# EAGLE design working (EAGLE 7.7.0)
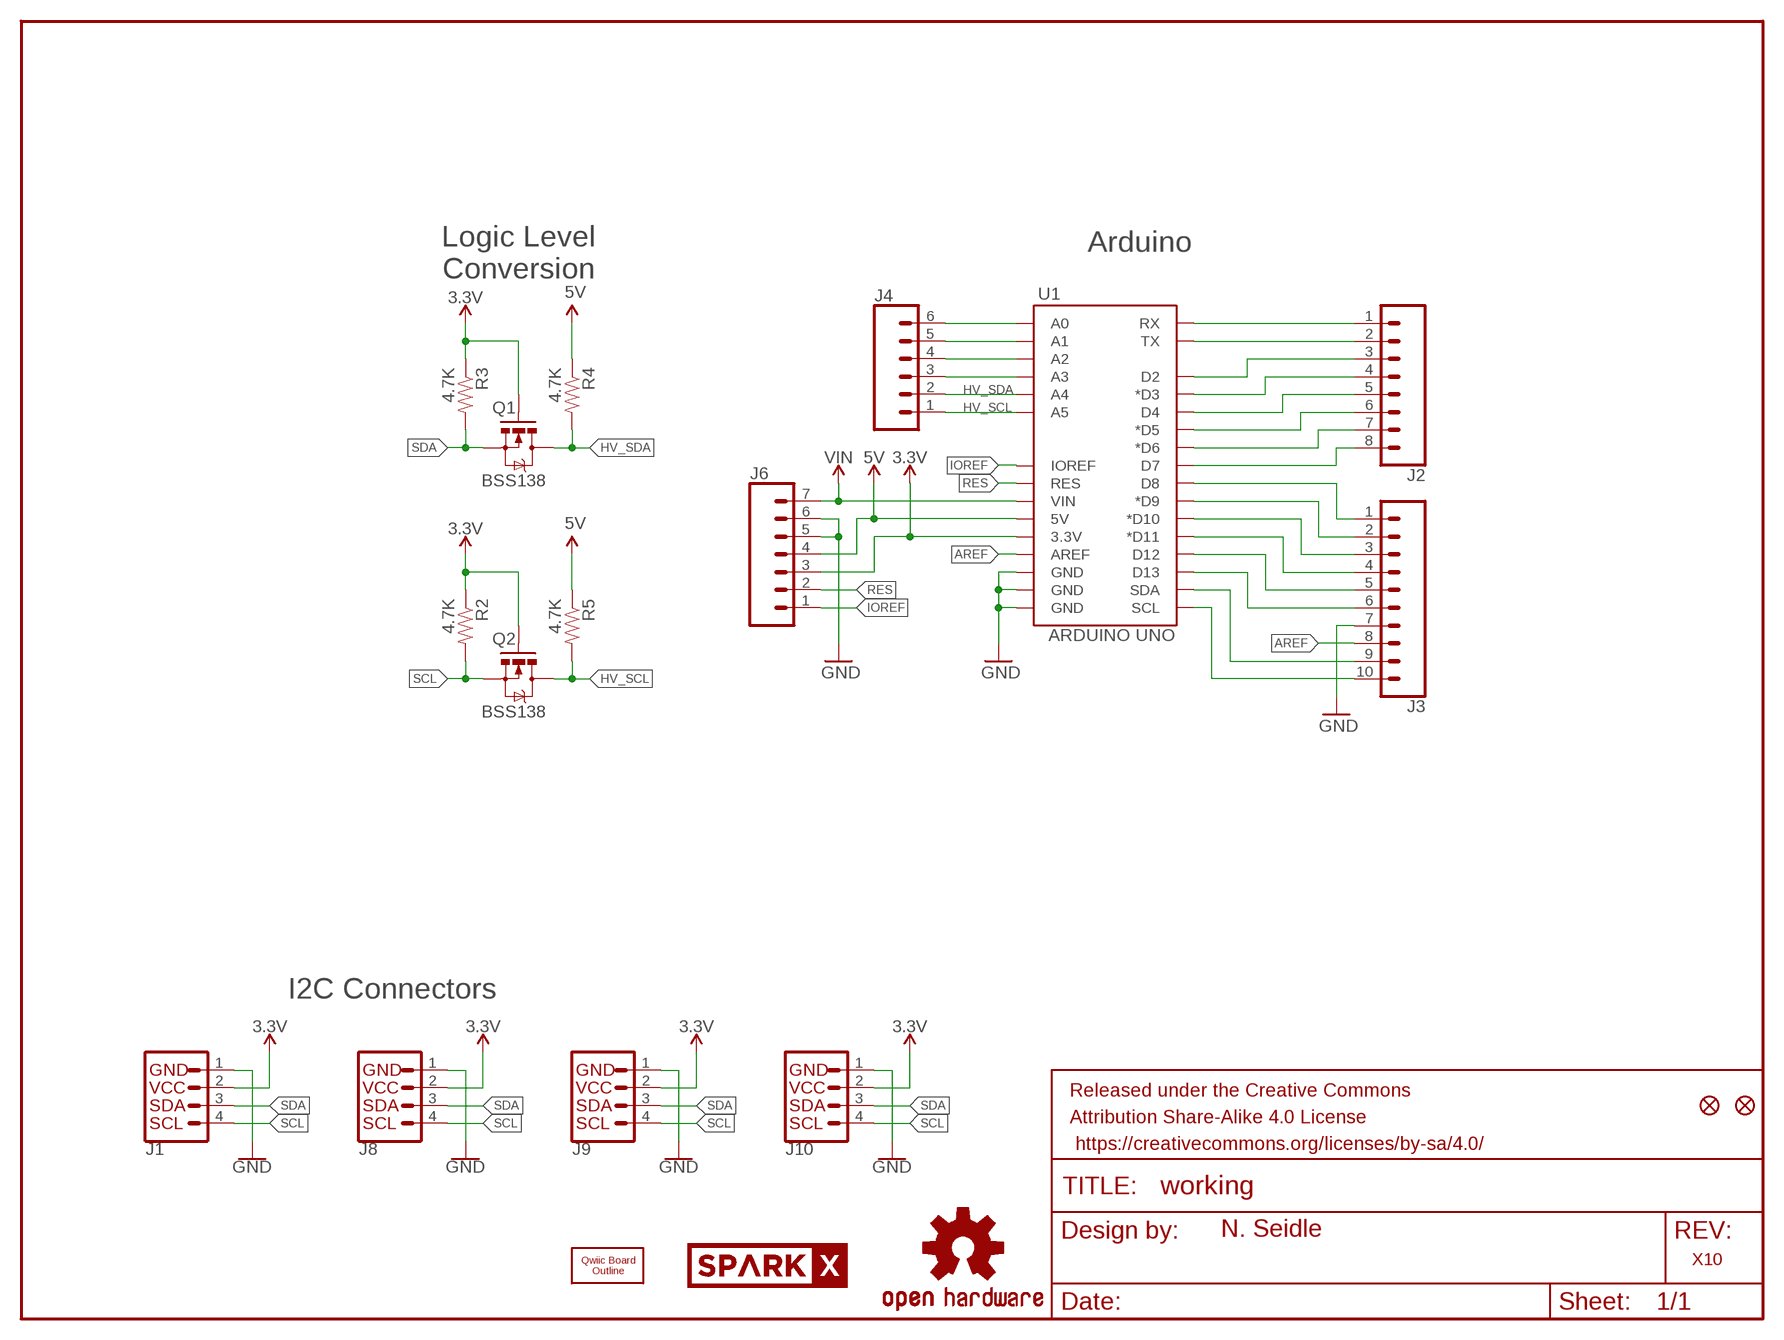
[diagram p0: schematic, sheet 1]

## Parts
FD1  FIDUCIAL1X2  [FIDUCIAL-1X2]
FD2  FIDUCIAL1X2  [FIDUCIAL-1X2]
FRAME1  FRAME-LETTER  [CREATIVE_COMMONS]
J1  I2C_STANDARDJS-1MM  [1X04_1MM_RA]
J2  CONN_08NO_SILK_FEMALE_PTH  [1X08_NO_SILK]
J3  CONN_10NO_SILK_PTH_FEMALE  [1X10_NO_SILK]
J4  CONN_06NO_SILK_FEMALE_PTH  [1X06_NO_SILK]
J6  CONN_07NO_SILK  [1X07_NO_SILK]
J8  I2C_STANDARDJS-1MM  [1X04_1MM_RA]
J9  I2C_STANDARDJS-1MM  [1X04_1MM_RA]
J10  I2C_STANDARDJS-1MM  [1X04_1MM_RA]
LOGO1  OSHW-LOGOMINI  [OSHW-LOGO-MINI]
Q1  BSS138  MOSFET-NCHANNELBSS138  [SOT23-3]
Q2  BSS138  MOSFET-NCHANNELBSS138  [SOT23-3]
R2  4.7K  4.7KOHM-1/10W-1%(0603)  [0603-RES]
R3  4.7K  4.7KOHM-1/10W-1%(0603)  [0603-RES]
R4  4.7K  4.7KOHM-1/10W-1%(0603)  [0603-RES]
R5  4.7K  4.7KOHM-1/10W-1%(0603)  [0603-RES]
U1  ARDUINO UNO  ARDUINO_R3_SHIELDNOLABELS  [UNO_R3_SHIELD_NOLABELS]
U$1  SPARKX-LOGO3  [SPARKX-SMALL]
U$2  SPARKX-LOGO5  [SPARKX-LARGE]
U$3  QWIIC_BOARD_OUTLINEH  [QWIIC_BOARD_MOUNT_HOLES]

## Nets
3.3V: J1.2(VCC) J6.3 J8.2(VCC) J9.2(VCC) J10.2(VCC) Q1.1(G) Q2.1(G) R2.1 R3.1 U1.3.3V
5V: J6.4 R4.1 R5.1 U1.5V
A0: J4.6 U1.A0
A1: J4.5 U1.A1
A2: J4.4 U1.A2
A3: J4.3 U1.A3
AREF: J3.8 U1.AREF
D2: J2.3 U1.D2
D3: J2.4 U1.D3(*D3)
D4: J2.5 U1.D4
D5: J2.6 U1.D5(*D5)
D6: J2.7 U1.D6(*D6)
D7: J2.8 U1.D7
D8: J3.1 U1.D8
D9: J3.2 U1.D9(*D9)
D10: J3.3 U1.D10(*D10)
D11: J3.4 U1.D11(*D11)
D12: J3.5 U1.D12
D13: J3.6 U1.D13
GND [vcc]: J1.1(GND) J3.7 J6.5 J6.6 J8.1(GND) J9.1(GND) J10.1(GND) U1.GND@0(GND) U1.GND@1(GND) U1.GND@2(GND)
HV_SCL: J4.1 Q2.3(D) R5.2 U1.A5
HV_SDA: J4.2 Q1.3(D) R4.2 U1.A4
IOREF: J6.1 U1.IOREF
RES: J6.2 U1.RES
RX: J2.1 U1.RX
SCL: J1.4(SCL) J8.4(SCL) J9.4(SCL) J10.4(SCL) Q2.2(S) R2.2
SCL1: J3.10 U1.SCL
SDA: J1.3(SDA) J8.3(SDA) J9.3(SDA) J10.3(SDA) Q1.2(S) R3.2
SDA1: J3.9 U1.SDA
TX: J2.2 U1.TX
VIN [vcc]: J6.7 U1.VIN

## Notes on the sheet
- Logic Level
  Conversion
- Arduino
- I2C Connectors
- N. Seidle
- X10

## Library data of the parts
FD1 FD2 = SparkFun-Aesthetics:FIDUCIAL: Fiducial Alignment Points Various fiducial points for machine vision alignment.
FRAME1 = SparkFun-Aesthetics:FRAME-LETTER: Schematic Frame Standard 8.5x11 US Letter frame
J1 J8-J10 = SparkX:I2C_STANDARD: SparkFun I2C Standard Pinout Header SparkFun has standardized on a pinout for all I2C based sensor breakouts. This pinout allows I2C boards to be plugged directly into the headers on Arduino Uno compatible boards, and to be daisy chained easily. Example SparkFun Products: SparkFun Atmospheric Sensor Breakout - BME280 <https://www.sparkfun.com/products/13676> SparkFun Altitude/Pressure Sensor Breakout - MPL3115A2 <https://www.sparkfun.com/products/11084> SparkFun TOF Range Finder Sensor - VL6180 <https://www.sparkfun.com/products/12785>
J2 = SparkFun-Connectors:CONN_08: Multi connection point. Often used as Generic Header-pin footprint for 0.1 inch spaced/style header connections On any of the 0.1 inch spaced packages, you can populate with these: Break Away Headers - Straight <https://www.sparkfun.com/products/116> (PRT-00116) Break Away Male Headers - Right Angle <https://www.sparkfun.com/products/553> (PRT-00553) Female Headers <https://www.sparkfun.com/products/115> (PRT-00115) Break Away Headers - Machine Pin <https://www.sparkfun.com/products/117> (PRT-00117) Break Away Female Headers - Swiss Machine Pin <https://www.sparkfun.com/products/743> (PRT-00743) Arduino Stackable Header - 8 Pin <https://www.sparkfun.com/products/9279> (PRT-09279) For SCREWTERMINALS and SPRING TERMINALS visit here: Screw Terimnals on SparkFun.com <https://www.sparkfun.com/search/results?term=Screw+Terminals> (5mm/3.5mm/2.54mm spacing) This device is also useful as a general connection point to wire up your design to another part of your project. Our various solder wires solder well into these plated through hole pads. Hook-Up Wire - Assortment (Stranded, 22 AWG) <https://www.sparkfun.com/products/11375> (PRT-11375) Hook-Up Wire - Assortment (Solid Core, 22 AWG) <https://www.sparkfun.com/products/11367> (PRT-11367) View the entire wire category on our website here <https://www.sparkfun.com/categories/141> Special notes: Molex polarized connector foot print use with SKU : PRT-08231 with associated crimp pins and housings. 1MM SMD Version SKU: PRT-10208 NOTES ON THE VARIANTS LOCK and LOCK_LONGPADS... This footprint was designed to help hold the alignment of a through-hole component (i.e. 6-pin header) while soldering it into place. You may notice that each hole has been shifted either up or down by 0.005 of an inch from it's more standard position (which is a perfectly straight line). This slight alteration caused the pins (the squares in the middle) to touch the edges of the holes. Because they are alternating, it causes a "brace" to hold the component in place. 0.005 has proven to be the perfect amount of "off-center" position when using our standard breakaway headers. Although looks a little odd when you look at the bare footprint, once you have a header in there, the alteration is very hard to notice. Also,if you push a header all the way into place, it is covered up entirely on the bottom side.; PROD_ID: CONN-08438
J3 = SparkFun-Connectors:CONN_10: Multi connection point. Often used as Generic Header-pin footprint for 0.1 inch spaced/style header connections On any of the 0.1 inch spaced packages, you can populate with these: Break Away Headers - Straight <https://www.sparkfun.com/products/116> (PRT-00116) Break Away Male Headers - Right Angle <https://www.sparkfun.com/products/553> (PRT-00553) Female Headers <https://www.sparkfun.com/products/115> (PRT-00115) Break Away Headers - Machine Pin <https://www.sparkfun.com/products/117> (PRT-00117) Break Away Female Headers - Swiss Machine Pin <https://www.sparkfun.com/products/743> (PRT-00743) Arduino Stackable Header - 10 Pin <https://www.sparkfun.com/products/11376> (PRT-11376) For SCREWTERMINALS and SPRING TERMINALS visit here: Screw Terimnals on SparkFun.com <https://www.sparkfun.com/search/results?term=Screw+Terminals> (5mm/3.5mm/2.54mm spacing) This device is also useful as a general connection point to wire up your design to another part of your project. Our various solder wires solder well into these plated through hole pads. Hook-Up Wire - Assortment (Stranded, 22 AWG) <https://www.sparkfun.com/products/11375> (PRT-11375) Hook-Up Wire - Assortment (Solid Core, 22 AWG) <https://www.sparkfun.com/products/11367> (PRT-11367) View the entire wire category on our website here <https://www.sparkfun.com/categories/141> Special notes: Molex polarized connector foot print use with SKU : PRT-08231 with associated crimp pins and housings. 1MM SMD Version SKU: PRT-10208 NOTES ON THE VARIANTS LOCK and LOCK_LONGPADS... This footprint was designed to help hold the alignment of a through-hole component (i.e. 6-pin header) while soldering it into place. You may notice that each hole has been shifted either up or down by 0.005 of an inch from it's more standard position (which is a perfectly straight line). This slight alteration caused the pins (the squares in the middle) to touch the edges of the holes. Because they are alternating, it causes a "brace" to hold the component in place. 0.005 has proven to be the perfect amount of "off-center" position when using our standard breakaway headers. Although looks a little odd when you look at the bare footprint, once you have a header in there, the alteration is very hard to notice. Also,if you push a header all the way into place, it is covered up entirely on the bottom side.; PROD_ID: CONN-11563
J4 = SparkFun-Connectors:CONN_06: Multi connection point. Often used as Generic Header-pin footprint for 0.1 inch spaced/style header connections On any of the 0.1 inch spaced packages, you can populate with these: Break Away Headers - Straight <https://www.sparkfun.com/products/116> (PRT-00116) Break Away Male Headers - Right Angle <https://www.sparkfun.com/products/553> (PRT-00553) Female Headers <https://www.sparkfun.com/products/115> (PRT-00115) Break Away Headers - Machine Pin <https://www.sparkfun.com/products/117> (PRT-00117) Break Away Female Headers - Swiss Machine Pin <https://www.sparkfun.com/products/743> (PRT-00743) Arduino Stackable Header - 6 Pin <https://www.sparkfun.com/products/9280> (PRT-09280) For SCREWTERMINALS and SPRING TERMINALS visit here: Screw Terimnals on SparkFun.com <https://www.sparkfun.com/search/results?term=Screw+Terminals> (5mm/3.5mm/2.54mm spacing) This device is also useful as a general connection point to wire up your design to another part of your project. Our various solder wires solder well into these plated through hole pads. Hook-Up Wire - Assortment (Stranded, 22 AWG) <https://www.sparkfun.com/products/11375> (PRT-11375) Hook-Up Wire - Assortment (Solid Core, 22 AWG) <https://www.sparkfun.com/products/11367> (PRT-11367) View the entire wire category on our website here <https://www.sparkfun.com/categories/141>; PROD_ID: CONN-08437
J6 = SparkFun-Connectors:CONN_07: Multi connection point. Often used as Generic Header-pin footprint for 0.1 inch spaced/style header connections On any of the 0.1 inch spaced packages, you can populate with these: Break Away Headers - Straight <https://www.sparkfun.com/products/116> (PRT-00116) Break Away Male Headers - Right Angle <https://www.sparkfun.com/products/553> (PRT-00553) Female Headers <https://www.sparkfun.com/products/115> (PRT-00115) Break Away Headers - Machine Pin <https://www.sparkfun.com/products/117> (PRT-00117) Break Away Female Headers - Swiss Machine Pin <https://www.sparkfun.com/products/743> (PRT-00743) For SCREWTERMINALS and SPRING TERMINALS visit here: Screw Terimnals on SparkFun.com <https://www.sparkfun.com/search/results?term=Screw+Terminals> (5mm/3.5mm/2.54mm spacing) This device is also useful as a general connection point to wire up your design to another part of your project. Our various solder wires solder well into these plated through hole pads. Hook-Up Wire - Assortment (Stranded, 22 AWG) <https://www.sparkfun.com/products/11375> (PRT-11375) Hook-Up Wire - Assortment (Solid Core, 22 AWG) <https://www.sparkfun.com/products/11367> (PRT-11367) View the entire wire category on our website here <https://www.sparkfun.com/categories/141> Special notes: Molex polarized connector foot print use with SKU : PRT-08231 with associated crimp pins and housings. 1MM SMD Version SKU: PRT-10208 NOTES ON THE VARIANTS LOCK and LOCK_LONGPADS... This footprint was designed to help hold the alignment of a through-hole component (i.e. 6-pin header) while soldering it into place. You may notice that each hole has been shifted either up or down by 0.005 of an inch from it's more standard position (which is a perfectly straight line). This slight alteration caused the pins (the squares in the middle) to touch the edges of the holes. Because they are alternating, it causes a "brace" to hold the component in place. 0.005 has proven to be the perfect amount of "off-center" position when using our standard breakaway headers. Although looks a little odd when you look at the bare footprint, once you have a header in there, the alteration is very hard to notice. Also,if you push a header all the way into place, it is covered up entirely on the bottom side.
LOGO1 = SparkFun-Aesthetics:OSHW-LOGO: Open Source Hardware Logo This logo indicates the piece of hardware it is found on incorporates a OSHW license and/or adheres to the definition of open source hardware found here: http://freedomdefined.org/OSHW
Q1 Q2 = SparkFun-DiscreteSemi:MOSFET-NCHANNEL: Common NMOSFET Parts MFG P/N Store ID Prod ID FDD8780 TRANS-09984 SI7820DN TRANS-11055 FDS6630A IC-08089 2N7002PW TRANS-11151 FQP30N06L COM-10213 TRANS-10060 BSS123LT1G TRANS-08345 BSS138 TRANS-00830 BS170 2N7000; PROD_ID: TRANS-00830; VALUE: 200mA/50V
R2-R5 = SparkFun-Resistors:4.7KOHM-1/10W-1%(0603): RES-07857; PROD_ID: RES-07857
U1 = SparkFun-Boards:ARDUINO_R3_SHIELD: Shield form compatible with the Arduino Uno R3.
U$1 U$2 = SparkX:SPARKX-LOGO
U$3 = SparkX:QWIIC_BOARD_OUTLINE: Standard Outline of a Qwiic Board. Good for defining a spot on shields and board areas in which to mount a Qwiic Board.

## Net classes
0 Default: width 0.203 mm
1 vcc: width 0.203 mm

## Board
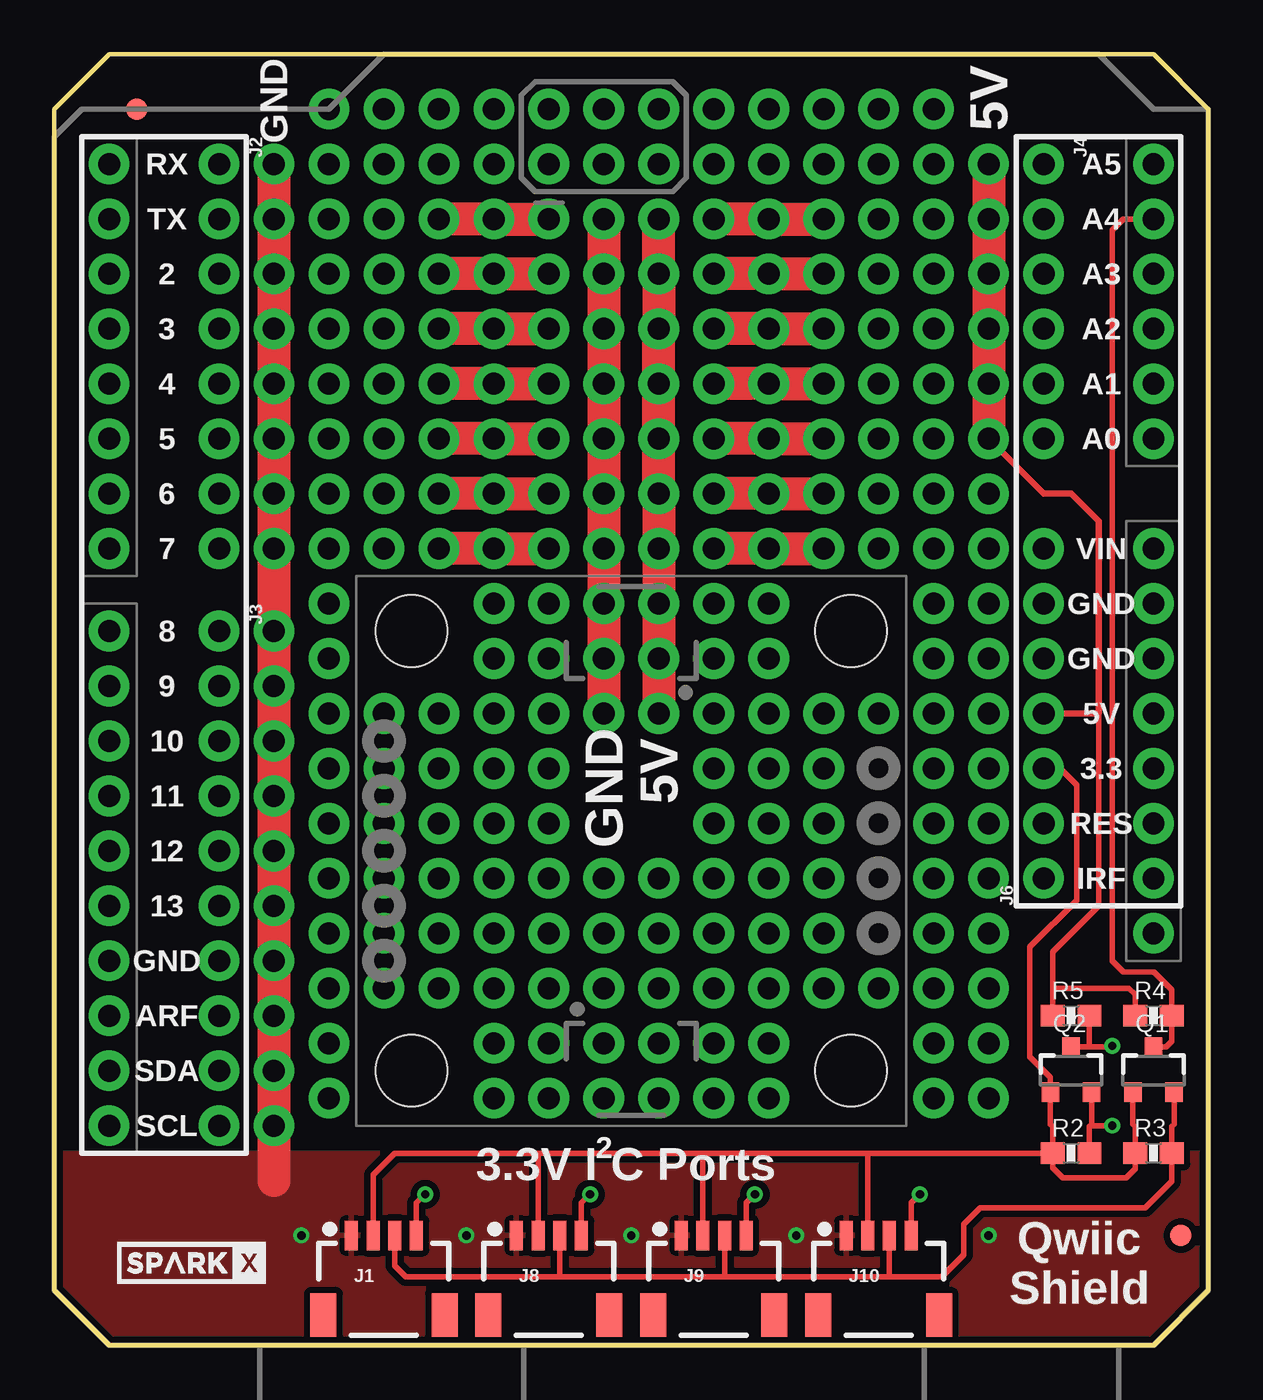
[diagram p1: board, top side]
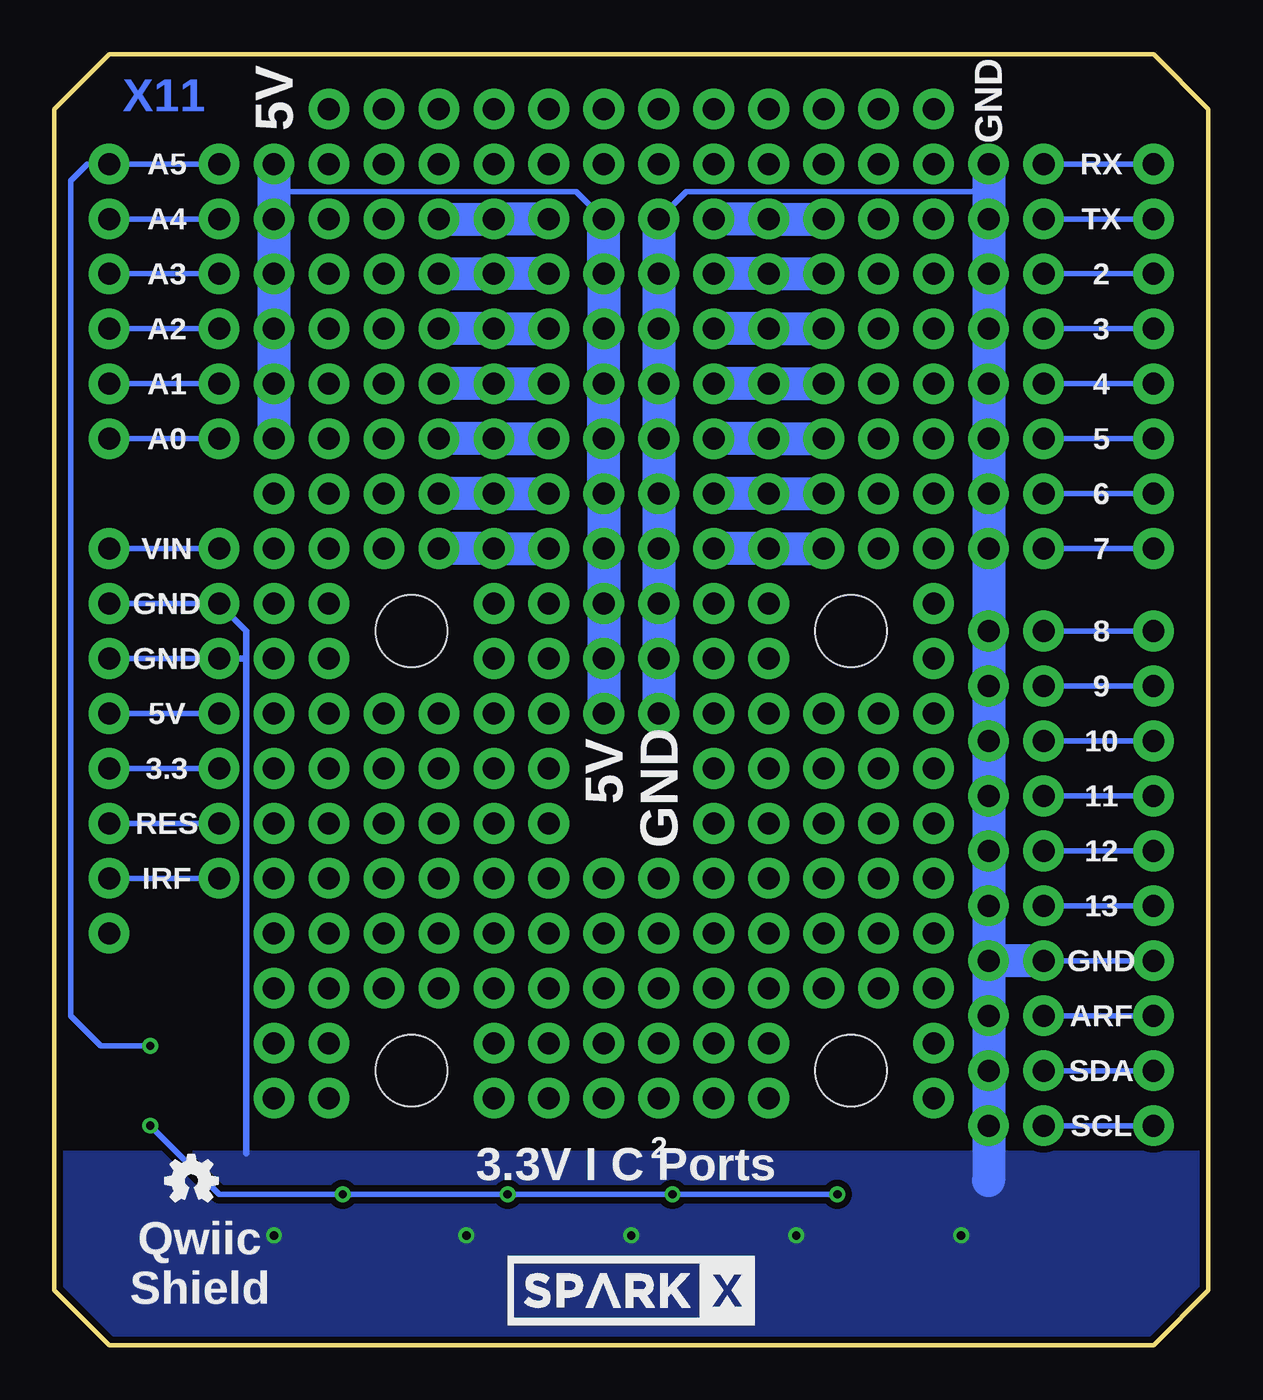
[diagram p2: board, bottom side, seen from below]

Size 53.34 x 59.69 mm. Coordinates in mm from the lower left corner, seen from the top.
Outline: 53.34,2.54 53.34,57.15 50.8,59.69 2.54,59.69 0,57.15 0,2.54 2.54,0 50.8,0 53.34,2.54
Copper layers (1*16): Top 0.035mm / dielectric 1.5mm / Bottom 0.035mm
Design rules "SparkFun-2-layer-TIGHT": minimum track width 7mil, minimum drill 15mil, track to track 7mil, track to pad 7mil, pad to pad 7mil, via to via 7mil, smd to smd 7mil, copper to edge 7mil, drill to drill 7mil, minimum pad ring 7mil, minimum via ring 7mil, stop-mask expansion 4mil, vias tented up to drill 25mil, thermal gap 10mil

### Footprints (pad centres in the part's own frame; a part is rotated, then mirrored left to right if it is on the bottom)
FIDUCIAL-1X2 = smd 1 x 1: 1 0,0
1X04_1MM_RA = smd 0.6 x 1.35: 1 -1.5,0; 2 -0.5,0; 3 0.5,0; 4 1.5,0 | smd 1.2 x 2: NC1 2.8,-3.675; NC2 -2.8,-3.675
1X08_NO_SILK = drill 1.016 pad 1.88: 1 0,0; 2 2.54,0; 3 5.08,0; 4 7.62,0; 5 10.16,0; 6 12.7,0; 7 15.24,0; 8 17.78,0
1X10_NO_SILK = drill 1.016 pad 1.88: 1 0,0; 2 2.54,0; 3 5.08,0; 4 7.62,0; 5 10.16,0; 6 12.7,0; 7 15.24,0; 8 17.78,0; 9 20.32,0; 10 22.86,0
1X06_NO_SILK = drill 1.016 pad 1.88: 1 0,0; 2 2.54,0; 3 5.08,0; 4 7.62,0; 5 10.16,0; 6 12.7,0
1X07_NO_SILK = drill 1.016 pad 1.88: 1 0,0; 2 2.54,0; 3 5.08,0; 4 7.62,0; 5 10.16,0; 6 12.7,0; 7 15.24,0
SOT23-3 = smd 0.8 x 0.9: 1 -0.95,-1; 2 0.95,-1; 3 0,1.1
0603-RES = smd 1.1 x 1: 1 -0.85,0; 2 0.85,0
UNO_R3_SHIELD_NOLABELS = drill 1.016 pad 1.88: 3.3V 50.8,26.67; 5V 50.8,29.21; A0 50.8,41.91; A1 50.8,44.45; A2 50.8,46.99; A3 50.8,49.53; A4 50.8,52.07; A5 50.8,54.61; AREF 2.54,15.24; D2 2.54,49.53; D3 2.54,46.99; D4 2.54,44.45; D5 2.54,41.91; D6 2.54,39.37; D7 2.54,36.83; D8 2.54,33.02; D9 2.54,30.48; D10 2.54,27.94; D11 2.54,25.4; D12 2.54,22.86; D13 2.54,20.32; GND@0 50.8,31.75; GND@1 50.8,34.29; GND@2 2.54,17.78; IOREF 50.8,21.59; NC 50.8,19.05; RES 50.8,24.13; RX 2.54,54.61; SCL 2.54,10.16; SDA 2.54,12.7; TX 2.54,52.07; VIN 50.8,36.83
QWIIC_BOARD_MOUNT_HOLES = hole 3.302: -10.16,10.16; 10.16,10.16; 10.16,-10.16; -10.16,-10.16

### Placement (x,y rotation side)
FD1  52.07,5.08 0 top
FD2  3.81,57.15 0 top
FRAME1  -8.89,-24.13 0 top  (outside the outline)
J1  15.24,5.08 0 top
J2  7.62,54.61 270 top
J3  7.62,33.02 270 top
J4  45.72,54.61 270 top
J6  45.72,21.59 90 top
J8  22.86,5.08 0 top
J9  30.48,5.08 0 top
J10  38.1,5.08 0 top
LOGO1  46.99,7.62 0 bottom
Q1  50.8,12.7 0 top
Q2  46.99,12.7 0 top
R2  46.99,8.89 0 top
R3  50.8,8.89 0 top
R4  50.8,15.24 0 top
R5  46.99,15.24 0 top
U1  0,0 0 top
U$1  6.35,3.81 0 top
U$2  26.67,2.54 0 bottom
U$3  26.67,22.86 90 top

### Tracks (layer width: path | path; a pad name or v marks a point on that pad's centre or on a via)
3.3V
  Top 0.254: R2.1 37.59,8.89 | 37.59,8.89 29.97,8.89 | 29.97,8.89 22.35,8.89 | 22.35,8.89 15.75,8.89 14.74,7.88 J1.2 | J8.2 22.36,8.88 22.35,8.89 | J9.2 29.98,8.88 29.97,8.89 | J10.2 37.6,8.88 37.59,8.89 | R2.1 46.14,10.12 46.04,10.22 Q2.1 46.04,12.38 45.09,13.34 45.09,18.41 47.24,20.57 47.24,25.91 46.48,26.67 J6.3 | Q1.1 49.85,10.22 49.95,10.12 R3.1 49.95,8.17 49.53,7.75 46.61,7.75 46.14,8.22 R2.1
  Bottom 0.254: J6.3 U1.3.3V
5V  (via drill 1.02 pad 1.88)
  Top 0.254: R4.1 49.95,16.22 49.66,16.51 46.14,16.51 | R5.1 46.14,16.51 | 46.14,16.51 46.14,18.2 48.26,20.32 48.26,29.21
  Top 0.305: v43.18,41.91 45.72,39.37 46.99,39.37 48.26,38.1 48.26,29.21 J6.4
  Top 1.524: v27.94,52.07 v27.94,49.53 v27.94,46.99 v27.94,44.45 v27.94,41.91 v27.94,39.37 v27.94,36.83 v27.94,34.29 v27.94,31.75 v27.94,29.21 | v43.18,54.61 v43.18,52.07 v43.18,49.53 v43.18,46.99 v43.18,44.45 v43.18,41.91
  Bottom 0.254: J6.4 U1.5V | v27.94,52.07 29.21,53.34 43.18,53.34
  Bottom 1.524: v43.18,54.61 43.18,53.34 v43.18,41.91 | v27.94,52.07 v27.94,49.53 v27.94,46.99 v27.94,44.45 v27.94,41.91 v27.94,39.37 v27.94,36.83 v27.94,34.29 v27.94,31.75 v27.94,29.21
A0
  Bottom 0.254: J4.6 U1.A0
A1
  Bottom 0.254: U1.A1 J4.5
A2
  Bottom 0.254: J4.4 U1.A2
A3
  Bottom 0.254: U1.A3 J4.3
AREF
  Bottom 0.254: U1.AREF J3.8
CH1  (via drill 1.02 pad 1.88)
  Top 1.524: v30.48,52.07 v33.02,52.07 v35.56,52.07
  Bottom 1.524: v30.48,52.07 v33.02,52.07 v35.56,52.07
CH2  (via drill 1.02 pad 1.88)
  Top 1.524: v30.48,49.53 v33.02,49.53 v35.56,49.53
  Bottom 1.524: v35.56,49.53 v33.02,49.53 v30.48,49.53
CH3  (via drill 1.02 pad 1.88)
  Top 1.524: v30.48,46.99 v33.02,46.99 v35.56,46.99
  Bottom 1.524: v35.56,46.99 v33.02,46.99 v30.48,46.99
CH4  (via drill 1.02 pad 1.88)
  Top 1.524: v30.48,44.45 v33.02,44.45 v35.56,44.45
  Bottom 1.524: v35.56,44.45 v33.02,44.45 v30.48,44.45
CH5  (via drill 1.02 pad 1.88)
  Top 1.524: v30.48,41.91 v33.02,41.91 v35.56,41.91
  Bottom 1.524: v35.56,41.91 v33.02,41.91 v30.48,41.91
CH6  (via drill 1.02 pad 1.88)
  Top 1.524: v30.48,39.37 v33.02,39.37 v35.56,39.37
  Bottom 1.524: v35.56,39.37 v33.02,39.37 v30.48,39.37
CH7  (via drill 1.02 pad 1.88)
  Top 1.524: v30.48,36.83 v33.02,36.83 v35.56,36.83
  Bottom 1.524: v35.56,36.83 v33.02,36.83 v30.48,36.83
CH9  (via drill 1.02 pad 1.88)
  Top 1.524: v17.78,52.07 v20.32,52.07 v22.86,52.07
  Bottom 1.524: v22.86,52.07 v20.32,52.07 v17.78,52.07
CH10  (via drill 1.02 pad 1.88)
  Top 1.524: v17.78,49.53 v20.32,49.53 v22.86,49.53
  Bottom 1.524: v22.86,49.53 v20.32,49.53 v17.78,49.53
CH11  (via drill 1.02 pad 1.88)
  Top 1.524: v17.78,46.99 v20.32,46.99 v22.86,46.99
  Bottom 1.524: v22.86,46.99 v20.32,46.99 v17.78,46.99
CH12  (via drill 1.02 pad 1.88)
  Top 1.524: v17.78,44.45 v20.32,44.45 v22.86,44.45
  Bottom 1.524: v22.86,44.45 v20.32,44.45 v17.78,44.45
CH13  (via drill 1.02 pad 1.88)
  Top 1.524: v17.78,41.91 v20.32,41.91 v22.86,41.91
  Bottom 1.524: v22.86,41.91 v20.32,41.91 v17.78,41.91
CH14  (via drill 1.02 pad 1.88)
  Top 1.524: v17.78,39.37 v20.32,39.37 v22.86,39.37
  Bottom 1.524: v22.86,39.37 v20.32,39.37 v17.78,39.37
CH15  (via drill 1.02 pad 1.88)
  Top 1.524: v17.78,36.83 v20.32,36.83 v22.86,36.83
  Bottom 1.524: v22.86,36.83 v20.32,36.83 v17.78,36.83
D2
  Bottom 0.254: J2.3 U1.D2
D3
  Bottom 0.254: U1.D3 J2.4
D4
  Bottom 0.254: J2.5 U1.D4
D5
  Bottom 0.254: U1.D5 J2.6
D6
  Bottom 0.254: J2.7 U1.D6
D7
  Bottom 0.254: U1.D7 J2.8
D8
  Bottom 0.254: J3.1 U1.D8
D9
  Bottom 0.254: U1.D9 J3.2
D10
  Bottom 0.254: J3.3 U1.D10
D11
  Bottom 0.254: U1.D11 J3.4
D12
  Bottom 0.254: J3.5 U1.D12
D13
  Bottom 0.254: U1.D13 J3.6
GND  (via drill 0.38, 1.02 pad 1.88)
  Top 0.305: 25.4,52.7 v25.4,52.07
  Top 1.524: v25.4,52.07 v25.4,49.53 v25.4,46.99 v25.4,44.45 v25.4,41.91 v25.4,39.37 v25.4,36.83 v25.4,34.29 v25.4,31.75 v25.4,29.21 | v10.16,54.61 v10.16,52.07 v10.16,49.53 v10.16,46.99 v10.16,44.45 v10.16,41.91 v10.16,39.37 v10.16,36.83 v10.16,33.02 v10.16,30.48 v10.16,27.94 v10.16,25.4 v10.16,22.86 v10.16,20.32 v10.16,17.78 v10.16,15.24 v10.16,12.7 v10.16,10.16 10.16,7.62
  Bottom 0.254: U1.GND@1 J6.6 | J6.5 U1.GND@0 | J3.7 U1.GND@2 | 25.4,52.7 24.77,52.7 24.13,53.34 10.16,53.34
  Bottom 0.305: J6.6 44.45,33.02 44.45,31.75 | 44.45,31.75 44.45,8.89 | J6.5 44.45,31.75 | 25.4,52.7 v25.4,52.07
  Bottom 1.524: J3.7 v10.16,17.78 | 10.16,7.62 v10.16,10.16 v10.16,33.02 v10.16,36.83 v10.16,39.37 v10.16,41.91 v10.16,44.45 v10.16,46.99 v10.16,49.53 v10.16,52.07 10.16,53.34 v10.16,54.61 | v25.4,52.07 v25.4,49.53 v25.4,46.99 v25.4,44.45 v25.4,41.91 v25.4,39.37 v25.4,36.83 v25.4,34.29 v25.4,31.75 v25.4,29.21
  other vias: 34.29,5.08 26.67,5.08 19.05,5.08 11.43,5.08 43.18,5.08
  pour Top (isolate 0.305): 53.34,0 0,0 0,8.89 53.34,8.89
  pour Bottom (isolate 0.305): 53.34,0 0,0 0,8.89 53.34,8.89
HV_SCL  (via drill 0.38)
  Top 0.254: Q2.3 47.88,13.8 | 47.88,13.8 48.85,13.8 v48.9,13.84 | R5.2 47.84,13.84 47.88,13.8
  Bottom 0.254: J4.1 U1.A5 51.82,54.61 52.58,53.85 52.58,15.24 51.18,13.84 v48.9,13.84
HV_SDA
  Top 0.254: Q1.3 51.39,13.8 51.65,14.06 R4.2 51.65,16.42 50.8,17.27 49.4,17.27 48.9,17.78 48.9,51.56 49.4,52.07 U1.A4
  Bottom 0.254: J4.2 U1.A4
IOREF
  Bottom 0.254: J6.1 U1.IOREF
N$1  (via drill 1.02 pad 1.88)
  other vias: 15.24,57.15
N$2  (via drill 1.02 pad 1.88)
  other vias: 15.24,54.61
N$3  (via drill 1.02 pad 1.88)
  other vias: 15.24,52.07
N$4  (via drill 1.02 pad 1.88)
  other vias: 12.7,57.15
N$5  (via drill 1.02 pad 1.88)
  other vias: 12.7,54.61
N$6  (via drill 1.02 pad 1.88)
  other vias: 12.7,52.07
N$7  (via drill 1.02 pad 1.88)
  other vias: 12.7,49.53
N$8  (via drill 1.02 pad 1.88)
  other vias: 15.24,49.53
N$9  (via drill 1.02 pad 1.88)
  other vias: 15.24,46.99
N$10  (via drill 1.02 pad 1.88)
  other vias: 12.7,46.99
N$11  (via drill 1.02 pad 1.88)
  other vias: 12.7,44.45
N$12  (via drill 1.02 pad 1.88)
  other vias: 15.24,44.45
N$13  (via drill 1.02 pad 1.88)
  other vias: 15.24,41.91
N$14  (via drill 1.02 pad 1.88)
  other vias: 12.7,41.91
N$15  (via drill 1.02 pad 1.88)
  other vias: 12.7,39.37
N$16  (via drill 1.02 pad 1.88)
  other vias: 15.24,39.37
N$17  (via drill 1.02 pad 1.88)
  other vias: 15.24,36.83
N$18  (via drill 1.02 pad 1.88)
  other vias: 12.7,36.83
N$19  (via drill 1.02 pad 1.88)
  other vias: 12.7,34.29
N$20  (via drill 1.02 pad 1.88)
  other vias: 17.78,54.61
N$21  (via drill 1.02 pad 1.88)
  other vias: 20.32,54.61
N$22  (via drill 1.02 pad 1.88)
  other vias: 22.86,54.61
N$23  (via drill 1.02 pad 1.88)
  other vias: 22.86,34.29
N$24  (via drill 1.02 pad 1.88)
  other vias: 20.32,34.29
N$25  (via drill 1.02 pad 1.88)
  other vias: 30.48,34.29
N$26  (via drill 1.02 pad 1.88)
  other vias: 33.02,34.29
N$27  (via drill 1.02 pad 1.88)
  other vias: 33.02,54.61
N$28  (via drill 1.02 pad 1.88)
  other vias: 30.48,54.61
N$29  (via drill 1.02 pad 1.88)
  other vias: 35.56,54.61
N$30  (via drill 1.02 pad 1.88)
  other vias: 38.1,36.83
N$31  (via drill 1.02 pad 1.88)
  other vias: 40.64,36.83
N$32  (via drill 1.02 pad 1.88)
  other vias: 40.64,39.37
N$33  (via drill 1.02 pad 1.88)
  other vias: 38.1,39.37
N$34  (via drill 1.02 pad 1.88)
  other vias: 38.1,41.91
N$35  (via drill 1.02 pad 1.88)
  other vias: 40.64,41.91
N$36  (via drill 1.02 pad 1.88)
  other vias: 40.64,44.45
N$37  (via drill 1.02 pad 1.88)
  other vias: 38.1,44.45
N$38  (via drill 1.02 pad 1.88)
  other vias: 38.1,46.99
N$39  (via drill 1.02 pad 1.88)
  other vias: 40.64,46.99
N$40  (via drill 1.02 pad 1.88)
  other vias: 40.64,49.53
N$41  (via drill 1.02 pad 1.88)
  other vias: 38.1,49.53
N$42  (via drill 1.02 pad 1.88)
  other vias: 38.1,52.07
N$43  (via drill 1.02 pad 1.88)
  other vias: 40.64,52.07
N$44  (via drill 1.02 pad 1.88)
  other vias: 40.64,54.61
N$45  (via drill 1.02 pad 1.88)
  other vias: 38.1,54.61
N$46  (via drill 1.02 pad 1.88)
  other vias: 38.1,57.15
N$47  (via drill 1.02 pad 1.88)
  other vias: 40.64,57.15
N$48  (via drill 1.02 pad 1.88)
  other vias: 12.7,31.75
N$49  (via drill 1.02 pad 1.88)
  other vias: 12.7,29.21
N$50  (via drill 1.02 pad 1.88)
  other vias: 15.24,29.21
N$51  (via drill 1.02 pad 1.88)
  other vias: 17.78,29.21
N$52  (via drill 1.02 pad 1.88)
  other vias: 20.32,29.21
N$53  (via drill 1.02 pad 1.88)
  other vias: 20.32,31.75
N$54  (via drill 1.02 pad 1.88)
  other vias: 22.86,31.75
N$55  (via drill 1.02 pad 1.88)
  other vias: 22.86,29.21
N$56  (via drill 1.02 pad 1.88)
  other vias: 22.86,26.67
N$57  (via drill 1.02 pad 1.88)
  other vias: 27.94,57.15
N$58  (via drill 1.02 pad 1.88)
  other vias: 27.94,54.61
N$59  (via drill 1.02 pad 1.88)
  other vias: 30.48,26.67
N$60  (via drill 1.02 pad 1.88)
  other vias: 30.48,29.21
N$61  (via drill 1.02 pad 1.88)
  other vias: 30.48,31.75
N$62  (via drill 1.02 pad 1.88)
  other vias: 33.02,31.75
N$63  (via drill 1.02 pad 1.88)
  other vias: 33.02,29.21
N$64  (via drill 1.02 pad 1.88)
  other vias: 33.02,26.67
N$65  (via drill 1.02 pad 1.88)
  other vias: 35.56,26.67
N$66  (via drill 1.02 pad 1.88)
  other vias: 35.56,29.21
N$67  (via drill 1.02 pad 1.88)
  other vias: 38.1,29.21
N$68  (via drill 1.02 pad 1.88)
  other vias: 40.64,29.21
N$69  (via drill 1.02 pad 1.88)
  other vias: 43.18,29.21
N$70  (via drill 1.02 pad 1.88)
  other vias: 43.18,31.75
N$71  (via drill 1.02 pad 1.88)
  other vias: 43.18,34.29
N$72  (via drill 1.02 pad 1.88)
  other vias: 43.18,36.83
N$73  (via drill 1.02 pad 1.88)
  other vias: 43.18,39.37
N$74  (via drill 1.02 pad 1.88)
  other vias: 40.64,34.29
N$75  (via drill 1.02 pad 1.88)
  other vias: 40.64,31.75
N$76  (via drill 1.02 pad 1.88)
  other vias: 43.18,26.67
N$77  (via drill 1.02 pad 1.88)
  other vias: 40.64,26.67
N$78  (via drill 1.02 pad 1.88)
  other vias: 43.18,24.13
N$79  (via drill 1.02 pad 1.88)
  other vias: 40.64,24.13
N$80  (via drill 1.02 pad 1.88)
  other vias: 38.1,24.13
N$81  (via drill 1.02 pad 1.88)
  other vias: 38.1,26.67
N$82  (via drill 1.02 pad 1.88)
  other vias: 35.56,24.13
N$83  (via drill 1.02 pad 1.88)
  other vias: 33.02,24.13
N$84  (via drill 1.02 pad 1.88)
  other vias: 30.48,24.13
N$87  (via drill 1.02 pad 1.88)
  other vias: 22.86,24.13
N$88  (via drill 1.02 pad 1.88)
  other vias: 20.32,24.13
N$89  (via drill 1.02 pad 1.88)
  other vias: 20.32,26.67
N$90  (via drill 1.02 pad 1.88)
  other vias: 17.78,26.67
N$91  (via drill 1.02 pad 1.88)
  other vias: 17.78,24.13
N$92  (via drill 1.02 pad 1.88)
  other vias: 15.24,24.13
N$93  (via drill 1.02 pad 1.88)
  other vias: 15.24,26.67
N$94  (via drill 1.02 pad 1.88)
  other vias: 12.7,26.67
N$95  (via drill 1.02 pad 1.88)
  other vias: 12.7,24.13
N$96  (via drill 1.02 pad 1.88)
  other vias: 12.7,21.59
N$97  (via drill 1.02 pad 1.88)
  other vias: 15.24,21.59
N$98  (via drill 1.02 pad 1.88)
  other vias: 17.78,21.59
N$99  (via drill 1.02 pad 1.88)
  other vias: 20.32,21.59
N$100  (via drill 1.02 pad 1.88)
  other vias: 22.86,21.59
N$101  (via drill 1.02 pad 1.88)
  other vias: 25.4,21.59
N$102  (via drill 1.02 pad 1.88)
  other vias: 27.94,21.59
N$103  (via drill 1.02 pad 1.88)
  other vias: 30.48,21.59
N$104  (via drill 1.02 pad 1.88)
  other vias: 33.02,21.59
N$105  (via drill 1.02 pad 1.88)
  other vias: 35.56,21.59
N$106  (via drill 1.02 pad 1.88)
  other vias: 38.1,21.59
N$107  (via drill 1.02 pad 1.88)
  other vias: 40.64,21.59
N$108  (via drill 1.02 pad 1.88)
  other vias: 43.18,21.59
N$109  (via drill 1.02 pad 1.88)
  other vias: 43.18,19.05
N$110  (via drill 1.02 pad 1.88)
  other vias: 40.64,19.05
N$111  (via drill 1.02 pad 1.88)
  other vias: 38.1,19.05
N$112  (via drill 1.02 pad 1.88)
  other vias: 35.56,19.05
N$113  (via drill 1.02 pad 1.88)
  other vias: 33.02,19.05
N$114  (via drill 1.02 pad 1.88)
  other vias: 30.48,19.05
N$115  (via drill 1.02 pad 1.88)
  other vias: 27.94,19.05
N$116  (via drill 1.02 pad 1.88)
  other vias: 25.4,19.05
N$117  (via drill 1.02 pad 1.88)
  other vias: 22.86,19.05
N$118  (via drill 1.02 pad 1.88)
  other vias: 20.32,19.05
N$119  (via drill 1.02 pad 1.88)
  other vias: 17.78,19.05
N$120  (via drill 1.02 pad 1.88)
  other vias: 15.24,19.05
N$121  (via drill 1.02 pad 1.88)
  other vias: 12.7,19.05
N$122  (via drill 1.02 pad 1.88)
  other vias: 12.7,16.51
N$123  (via drill 1.02 pad 1.88)
  other vias: 15.24,16.51
N$124  (via drill 1.02 pad 1.88)
  other vias: 17.78,16.51
N$125  (via drill 1.02 pad 1.88)
  other vias: 20.32,16.51
N$126  (via drill 1.02 pad 1.88)
  other vias: 22.86,16.51
N$127  (via drill 1.02 pad 1.88)
  other vias: 25.4,16.51
N$128  (via drill 1.02 pad 1.88)
  other vias: 27.94,16.51
N$129  (via drill 1.02 pad 1.88)
  other vias: 30.48,16.51
N$130  (via drill 1.02 pad 1.88)
  other vias: 33.02,16.51
N$131  (via drill 1.02 pad 1.88)
  other vias: 35.56,16.51
N$132  (via drill 1.02 pad 1.88)
  other vias: 38.1,16.51
N$133  (via drill 1.02 pad 1.88)
  other vias: 40.64,16.51
N$134  (via drill 1.02 pad 1.88)
  other vias: 43.18,16.51
N$135  (via drill 1.02 pad 1.88)
  other vias: 43.18,13.97
N$136  (via drill 1.02 pad 1.88)
  other vias: 40.64,13.97
N$137  (via drill 1.02 pad 1.88)
  other vias: 33.02,13.97
N$138  (via drill 1.02 pad 1.88)
  other vias: 30.48,13.97
N$139  (via drill 1.02 pad 1.88)
  other vias: 27.94,13.97
N$140  (via drill 1.02 pad 1.88)
  other vias: 25.4,13.97
N$141  (via drill 1.02 pad 1.88)
  other vias: 22.86,13.97
N$142  (via drill 1.02 pad 1.88)
  other vias: 20.32,13.97
N$143  (via drill 1.02 pad 1.88)
  other vias: 12.7,13.97
N$144  (via drill 1.02 pad 1.88)
  other vias: 12.7,11.43
N$145  (via drill 1.02 pad 1.88)
  other vias: 20.32,11.43
N$146  (via drill 1.02 pad 1.88)
  other vias: 22.86,11.43
N$147  (via drill 1.02 pad 1.88)
  other vias: 25.4,11.43
N$148  (via drill 1.02 pad 1.88)
  other vias: 27.94,11.43
N$149  (via drill 1.02 pad 1.88)
  other vias: 30.48,11.43
N$150  (via drill 1.02 pad 1.88)
  other vias: 33.02,11.43
N$151  (via drill 1.02 pad 1.88)
  other vias: 40.64,11.43
N$152  (via drill 1.02 pad 1.88)
  other vias: 43.18,11.43
N$153  (via drill 1.02 pad 1.88)
  other vias: 17.78,57.15
N$154  (via drill 1.02 pad 1.88)
  other vias: 20.32,57.15
N$155  (via drill 1.02 pad 1.88)
  other vias: 22.86,57.15
N$156  (via drill 1.02 pad 1.88)
  other vias: 25.4,57.15
N$157  (via drill 1.02 pad 1.88)
  other vias: 30.48,57.15
N$158  (via drill 1.02 pad 1.88)
  other vias: 33.02,57.15
N$159  (via drill 1.02 pad 1.88)
  other vias: 35.56,57.15
N$160  (via drill 1.02 pad 1.88)
  other vias: 25.4,54.61
RES
  Bottom 0.254: U1.RES J6.2
RX
  Bottom 0.254: J2.1 U1.RX
SCL  (via drill 0.38)
  Top 0.254: Q2.2 47.94,10.22 | 47.94,10.22 47.84,10.12 R2.2 | J10.4 39.6,6.58 v40.01,6.99 | v48.9,10.16 48,10.16 47.94,10.22 | J9.4 31.98,6.58 v32.38,6.99 | J8.4 24.36,6.58 v24.77,6.99 | J1.4 16.74,6.58 v17.14,6.99
  Bottom 0.254: v48.9,10.16 45.72,6.99 v40.01,6.99 v32.38,6.99 v24.77,6.99 v17.14,6.99
SCL1
  Bottom 0.254: J3.10 U1.SCL
SDA
  Top 0.254: Q1.2 51.75,10.22 51.65,10.12 R3.2 51.65,7.58 50.42,6.35 42.8,6.35 42.04,5.59 42.04,4.19 41.02,3.17 38.61,3.17 | J1.3 15.74,3.69 16.26,3.17 23.37,3.17 | 23.37,3.17 30.99,3.17 | 30.99,3.17 38.61,3.17 | J10.3 38.6,3.18 38.61,3.17 | J9.3 30.98,3.18 30.99,3.17 | J8.3 23.36,3.18 23.37,3.17
SDA1
  Bottom 0.254: U1.SDA J3.9
TX
  Bottom 0.254: U1.TX J2.2
VIN
  Bottom 0.254: J6.7 U1.VIN

### Text on the board
Bottom: X11
tPlace: GND | 5V | RX | A5 | TX | A4 | 2 | A3 | 3 | A2 | 4 | A1 | 5 | A0 | 6 | 7 | VIN | GND | 8 | GND | 9 | 5V | 10 | 5V | 3.3 | GND | 11 | RES | 12 | IRF | 13 | GND | ARF | SDA | SCL | 2 | 3.3V I C Ports | Qwiic / Shield
bPlace: GND | 5V | RX | A5 | TX | A4 | 2 | A3 | 3 | A2 | 4 | A1 | 5 | A0 | 6 | 7 | VIN | GND | 8 | GND | 9 | 5V | 10 | 5V | 3.3 | GND | 11 | RES | 12 | IRF | 13 | GND | ARF | SDA | SCL | 2 | 3.3V I C Ports | Qwiic / Shield
tDocu: N. Seidle